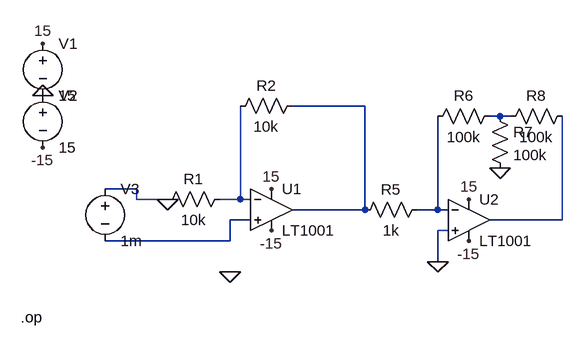
[diagram p0: schematic ia.asc]
ia.asc, the LTspice schematic file:
Version 4
SHEET 1 880 680
WIRE 224 16 112 16
WIRE 432 32 416 32
WIRE 448 32 432 32
WIRE -128 144 -176 144
WIRE -128 160 -128 144
WIRE -80 160 -128 160
WIRE 32 160 32 16
WIRE 32 160 0 160
WIRE 48 160 32 160
WIRE 224 176 224 16
WIRE 224 176 112 176
WIRE 336 176 336 32
WIRE 336 176 304 176
WIRE 352 176 336 176
WIRE 48 192 16 192
WIRE 528 192 528 32
WIRE 528 192 416 192
WIRE 352 208 336 208
WIRE 16 224 16 192
WIRE 16 224 -176 224
WIRE 336 256 336 208
FLAG -272 80 -15
FLAG -272 -80 15
FLAG 80 144 15
FLAG 384 160 15
FLAG 80 208 -15
FLAG 384 224 -15
FLAG 16 272 0
FLAG 336 256 0
FLAG -272 0 0
FLAG 432 112 0
FLAG -80 160 0
DATAFLAG 496 192 ""
DATAFLAG 224 176 ""
DATAFLAG 224 160 ""
SYMBOL OpAmps\\LT1001 80 112 R0
SYMATTR InstName U1
SYMBOL res 16 144 R90
WINDOW 0 0 56 VBottom 2
WINDOW 3 32 56 VTop 2
SYMATTR InstName R1
SYMATTR Value 10k
SYMBOL OpAmps\\LT1001 384 128 R0
SYMATTR InstName U2
SYMBOL res 320 160 R90
WINDOW 0 0 56 VBottom 2
WINDOW 3 32 56 VTop 2
SYMATTR InstName R5
SYMATTR Value 1k
SYMBOL voltage -272 -96 R0
WINDOW 123 0 0 Left 0
WINDOW 39 0 0 Left 0
SYMATTR InstName V1
SYMATTR Value 15
SYMBOL voltage -272 -16 R0
WINDOW 123 0 0 Left 0
WINDOW 39 0 0 Left 0
SYMATTR InstName V2
SYMATTR Value 15
SYMBOL res 128 0 R90
WINDOW 0 0 56 VBottom 2
WINDOW 3 32 56 VTop 2
SYMATTR InstName R2
SYMATTR Value 10k
SYMBOL voltage -176 128 R0
WINDOW 123 0 0 Left 0
WINDOW 39 0 0 Left 0
SYMATTR InstName V3
SYMATTR Value 1m
SYMBOL res 432 16 R90
WINDOW 0 0 56 VBottom 2
WINDOW 3 32 56 VTop 2
SYMATTR InstName R6
SYMATTR Value 100k
SYMBOL res 432 48 R270
WINDOW 0 32 56 VTop 2
WINDOW 3 0 56 VBottom 2
SYMATTR InstName R8
SYMATTR Value 100k
SYMBOL res 416 16 R0
SYMATTR InstName R7
SYMATTR Value 100k
TEXT -306 342 Left 2 !.op

The netlist it stands for:
* ia.asc
XU1 N005 N003 15 -15 N001 LT1001  ; pins In+ In- V+ V- OUT
R1 N003 0 10k
XU2 0 N004 15 -15 N006 LT1001  ; pins In+ In- V+ V- OUT
R5 N004 N001 1k
V1 15 0 15
V2 0 -15 15
R2 N001 N003 10k
V3 0 N005 1m
R6 N002 N004 100k
R8 N002 N006 100k
R7 N002 0 100k
.op
.lib LTC.lib
.backanno
.end